# Altium schematic sheet Sheet3.SchDoc
size A3; DocumentNumber: 3; SheetNumber: 3; SheetTotal: 4
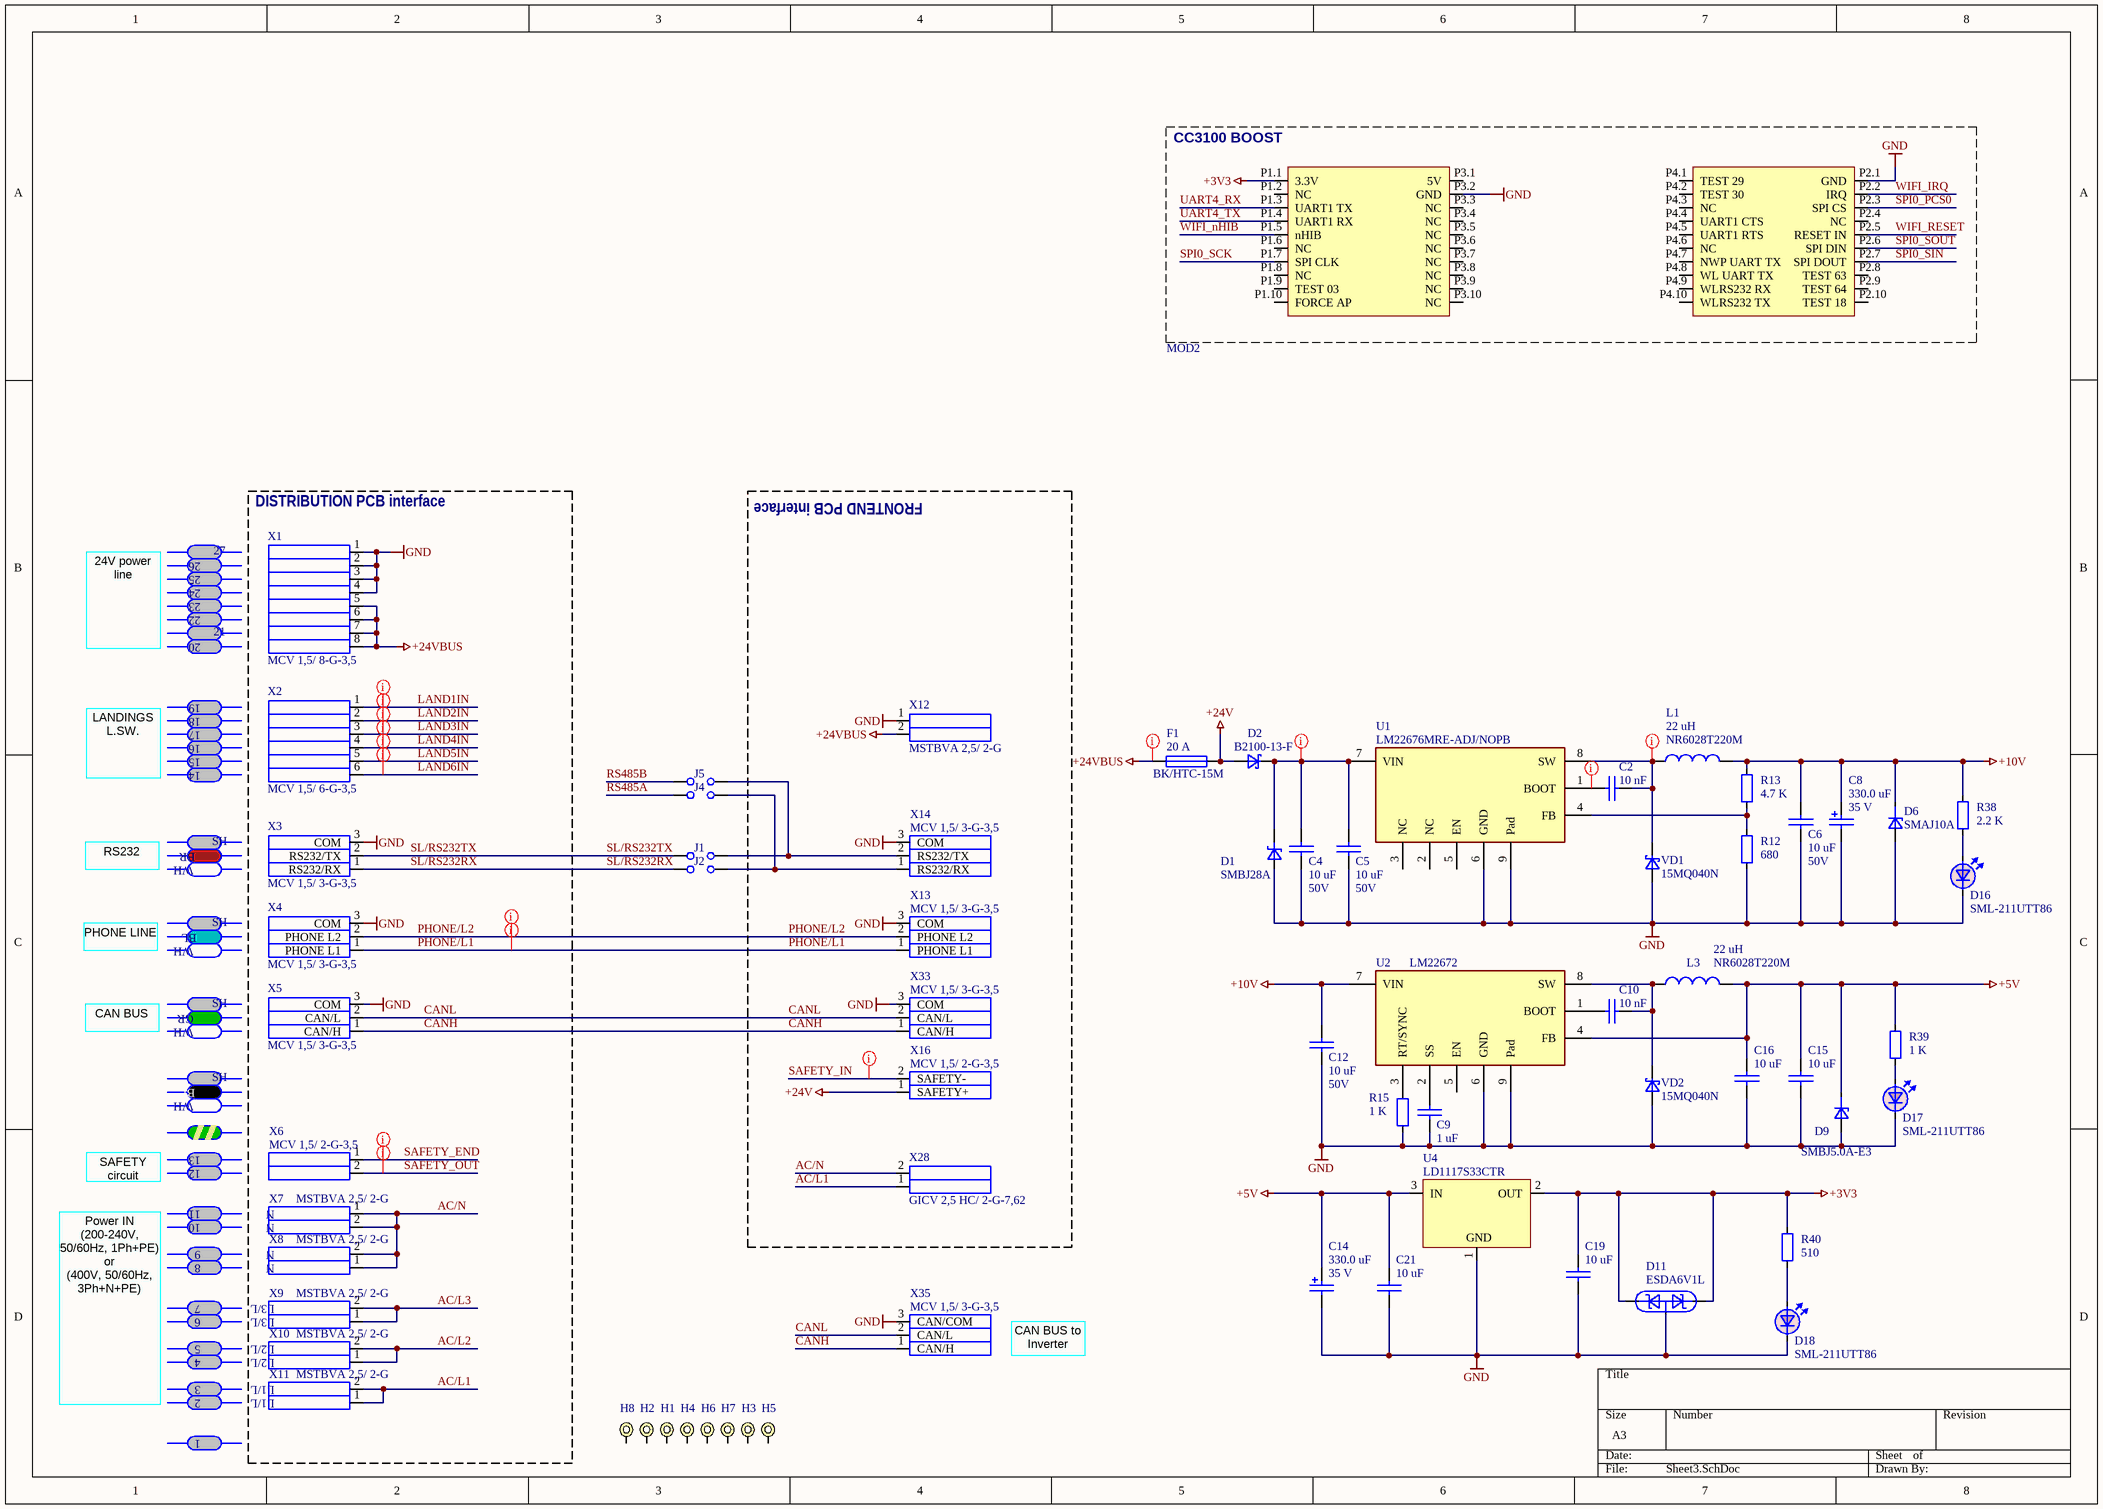
[diagram p0: Sheet3.SchDoc]

## Parts
C2  value 10 nF  [1608[0603]]  (hidden comment: CVNF010K0603)
C4  value 10 uF  Voltage: 50V  [3225[1210]]  (hidden comment: GRM32DF51H106ZA01L)
C5  value 10 uF  Voltage: 50V  [3225[1210]]  (hidden comment: GRM32DF51H106ZA01L)
C6  value 10 uF  Voltage: 50V  [3225[1210]]  (hidden comment: GRM32DF51H106ZA01L)
C8  value 330.0 uF  Voltage: 35 V  [Alum.SMD Cap. 10*10]  (hidden comment: UUD1V331MNL1GS)
C9  value 1 uF  [2012[0805]]  (hidden comment: GRM21BR71A105KA01L)
C10  value 10 nF  [1608[0603]]  (hidden comment: CVNF010K0603)
C12  value 10 uF  Voltage: 50V  [3225[1210]]  (hidden comment: GRM32DF51H106ZA01L)
C14  value 330.0 uF  Voltage: 35 V  [Alum.SMD Cap. 10*10]  (hidden comment: UUD1V331MNL1GS)
C15  value 10 uF  [0805-1206]  (hidden comment: C2012X5R1C106K085AC)
C16  value 10 uF  [0805-1206]  (hidden comment: C2012X5R1C106K085AC)
C19  value 10 uF  [0805-1206]  (hidden comment: C2012X5R1C106K085AC)
C21  value 10 uF  [0805-1206]  (hidden comment: C2012X5R1C106K085AC)
D1  SMBJ28A  [DO-214AA_SMBJ]
D2  B2100-13-F  [SMB ST]
D6  SMAJ10A  [SMA]
D9  SMBJ5.0A-E3  [DO-214AA_SMBJ]
D11  ESDA6V1L  [SOT23]
D16  SML-211UTT86  [0805 LED]
D17  SML-211UTT86  [0805 LED]
D18  SML-211UTT86  [0805 LED]
F1  BK/HTC-15M  value 20 A  [FUSE KS21SW]
H1  Hole 3MM Plated  [HOLE_3MM plated]  (value not drawn)  (no BOM)
H2  Hole 3MM Plated  [HOLE_3MM plated]  (value not drawn)  (no BOM)
H3  Hole 3MM Plated  [HOLE_3MM plated]  (value not drawn)  (no BOM)
H4  Hole 3MM Plated  [HOLE_3MM plated]  (value not drawn)  (no BOM)
H5  Hole 3MM Plated  [HOLE_3MM plated]  (value not drawn)  (no BOM)
H6  Hole 3MM Plated  [HOLE_3MM plated]  (value not drawn)  (no BOM)
H7  Hole 3MM Plated  [HOLE_3MM plated]  (value not drawn)  (no BOM)
H8  Hole 3MM Plated  [HOLE_3MM plated]  (value not drawn)  (no BOM)
J1  PH1-02-TA-HT  [HDR1X2V]  (value not drawn)
J2  PH1-02-TA-HT  [HDR1X2V]  (value not drawn)
J4  PH1-02-TA-HT  [HDR1X2V]  (value not drawn)
J5  PH1-02-TA-HT  [HDR1X2V]  (value not drawn)
L1  NR6028T220M  value 22 uH  [NR6028 yuden]
L3  NR6028T220M  value 22 uH  [NR6028 yuden]
MOD2  CC3100BOOST  [CC3100BOOST]  (value not drawn)  (no BOM)
R12  value 680  [0603]  (hidden comment: RL0603E680-1)
R13  value 4.7 K  [0603]  (hidden comment: RL0603K004.7-1)
R15  value 1 K  [0603]  (hidden comment: RC0603FR-071KL)
R38  value 2.2 K  [0603]  (hidden comment: RC0603FR-072K2L)
R39  value 1 K  [0603]  (hidden comment: RC0603FR-071KL)
R40  value 510  [0603]  (hidden comment: RL0603E510-1)
U1  LM22676MRE-ADJ/NOPB  [SOIC-8 EDP]
U2  LM22672  [SOIC-8 EDP]
U4  LD1117S33CTR  [SOT-223]
VD1  15MQ040N  [SMA]
VD2  15MQ040N  [SMA]
X1  MCV 1,5/ 8-G-3,5  [mcv1.5-8-g_3.5]
X2  MCV 1,5/ 6-G-3,5  [mcv1.5-6-g_3.5]
X3  MCV 1,5/ 3-G-3,5  [mcv1.5-3-g_3.5]
X4  MCV 1,5/ 3-G-3,5  [mcv1.5-3-g_3.5]
X5  MCV 1,5/ 3-G-3,5  [mcv1.5-3-g_3.5]
X6  MCV 1,5/ 2-G-3,5  [mcv1.5-2-g_3.5]
X7  MSTBVA 2,5/ 2-G  [CIM020P1]
X8  MSTBVA 2,5/ 2-G  [CIM020P1]
X9  MSTBVA 2,5/ 2-G  [CIM020P1]
X10  MSTBVA 2,5/ 2-G  [CIM020P1]
X11  MSTBVA 2,5/ 2-G  [CIM020P1]
X12  MSTBVA 2,5/ 2-G  [CIM020P1]
X13  MCV 1,5/ 3-G-3,5  [mcv1.5-3-g_3.5]
X14  MCV 1,5/ 3-G-3,5  [mcv1.5-3-g_3.5]
X16  MCV 1,5/ 2-G-3,5  [mcv1.5-2-g_3.5]
X28  GICV 2,5 HC/ 2-G-7,62  [1756485 GICV 2,5 HC/2 -G-7,62]
X33  MCV 1,5/ 3-G-3,5  [mcv1.5-3-g_3.5]
X35  MCV 1,5/ 3-G-3,5  [mcv1.5-3-g_3.5]

## Blocks framed on the sheet
DISTRIBUTION PCB interface: X1-X11
FRONTEND PCB interface: X12-X14 X16 X28 X33

## Nets
+3V3: C19.2 D11.1 D11.2 MOD2.P1.1(3.3V) R40.2 U4.2(OUT)
+5V: C14.1 C15.2 C16.2 C21.2 D9.1(C) L3.2 R39.2 U2.4(FB) U4.3(IN)
+10V: C6.1 C8.1 C12.1 D6.1 L1.2 R13.2 R38.2 U2.7(VIN)
+24V: D2.1(A) F1.1 X16.1(SAFETY+)
+24VBUS: F1.2 X1.5 X1.6 X1.7 X1.8 X12.2
GND: C4.2 C5.2 C6.2 C8.2 C9.1 C12.2 C14.2 C15.1 C16.1 C19.1 C21.1 D1.2(A) D6.2 D9.2(A) D11.3 D16.2 D17.2 D18.2 MOD2.P2.1(GND) MOD2.P3.2(GND) R12.1 R15.1 U1.6(GND) U1.9(Pad) U2.6(GND) U2.9(Pad) U4.1(GND) VD1.2 VD2.2 X1.1 X1.2 X1.3 X1.4 X3.3(COM) X4.3(COM) X5.3(COM) X12.1 X13.3(COM) X14.3(COM) X33.3(COM) X35.3(CAN/COM)
AC/L1: X11.1 X11.2 X28.1
AC/L2: X10.1 X10.2
AC/L3: X9.1 X9.2
AC/N: X7.1 X7.2 X8.1 X8.2 X28.2
CANH: X5.1(CAN/H) X33.1(CAN/H) X35.1(CAN/H)
CANL: X5.2(CAN/L) X33.2(CAN/L) X35.2(CAN/L)
LAND1IN: X2.1
LAND2IN: X2.2
LAND3IN: X2.3
LAND4IN: X2.4
LAND5IN: X2.5
LAND6IN: X2.6
PHONE/L1: X4.1(PHONE_L1) X13.1(PHONE_L1)
PHONE/L2: X4.2(PHONE_L2) X13.2(PHONE_L2)
RS485A: J4.1
RS485B: J5.1
SAFETY_END: X6.1
SAFETY_IN: X16.2(SAFETY-)
SAFETY_OUT: X6.2
SL/RS232RX: J2.1 X3.1(RS232/RX)
SL/RS232TX: J1.1 X3.2(RS232/TX)
SPI0_PCS0: MOD2.P2.3(SPI_CS)
SPI0_SCK: MOD2.P1.7(SPI_CLK)
SPI0_SIN: MOD2.P2.7(SPI_DOUT)
SPI0_SOUT: MOD2.P2.6(SPI_DIN)
UART4_RX: MOD2.P1.3(UART1_TX)
UART4_TX: MOD2.P1.4(UART1_RX)
WIFI_IRQ: MOD2.P2.2(IRQ)
WIFI_nHIB: MOD2.P1.5(nHIB)
WIFI_RESET: MOD2.P2.5(RESET_IN)
NetC2_1: C2.1 L1.1 U1.8(SW) VD1.1
NetC2_2: C2.2 U1.1(BOOT)
NetC4_1: C4.1 C5.1 D1.1(C) D2.2(C) U1.7(VIN)
NetC9_2: C9.2 U2.2(SS)
NetC10_1: C10.1 L3.1 U2.8(SW) VD2.1
NetC10_2: C10.2 U2.1(BOOT)
NetD16_1: D16.1 R38.1
NetD17_1: D17.1 R39.1
NetD18_1: D18.1 R40.1
NetJ1_2: J1.2 J5.2 X14.2(RS232/TX)
NetJ2_2: J2.2 J4.2 X14.1(RS232/RX)
NetR12_2: R12.2 R13.1 U1.4(FB)
NetR15_2: R15.2 U2.3(RT/SYNC)

Not connected (* = marked no-connect by the designer): H1 0; H2 0; H3 0; H4 0; H5 0; H6 0; H7 0; H8 0; MOD2 P1.2(NC) P1.6(NC) P1.8(NC) P1.9(TEST_03) P1.10(FORCE_AP) P2.4(NC) P2.8(TEST_63) P2.9(TEST_64) P2.10(TEST_18) P3.1(5V) P3.3(NC) P3.4(NC) P3.5(NC) P3.6(NC) P3.7(NC) P3.8(NC) P3.9(NC) P3.10(NC) P4.1(TEST_29) P4.2(TEST_30) P4.3(NC) P4.4(UART1_CTS) P4.5(UART1_RTS) P4.6(NC) P4.7(NWP_UART_TX) P4.8(WL_UART_TX) P4.9(WLRS232_RX) P4.10(WLRS232_TX); U1 2(NC) 3(NC) 5(EN); U2 5(EN)

## Layout directives
net class 24V: +24VBUS, LAND1IN, LAND2IN, LAND3IN, LAND4IN, LAND5IN, LAND6IN, NetC2_1, NetC2_2, NetC4_1, SAFETY_END, SAFETY_IN, SAFETY_OUT
net class 100V: PHONE/L1, PHONE/L2

## Notes on the sheet
- 26
- 25
- 24
- 27
- 24V power line
- 23
- 22
- 20
- 21
- 19
- 18
- 17
- LANDINGS L.SW.
- 16
- 15
- 14
- WH
- BR
- SH
- RS232
- PHONE LINE
- BL
- CAN BUS
- GR
- SAFETY circuit
- 13
- 12
- 11
- 10
- 9
- 8
- N
- 7
- 6
- L3/L
- 5
- 4
- 3
- 2
- L1/L
- L2/L
- CAN BUS to Inverter
- Power IN (200-240V, 50/60Hz, 1Ph+PE)
  or
  (400V, 50/60Hz, 3Ph+N+PE)
- 1
- (in symbol CC3100BOOST) CC3100 BOOST

## Library data of the parts
C2 C10 = CVNF010K0603: 10 nF, 50V, 10%, X7R, 0603 SMD MLC Capacitor; Manufacturer: Murata Electronics; PartNum: 490-1512-1-ND; PartName: GRM188R71H103KA01D; Tolerance: +-10%; Distributor: Digi-Key; Price: 0.006$; Voltage: 50 V
C4-C6 C12 = GRM32DF51H106ZA01L: 10uF, 50V, 20%, Y5V (F), 1210; Manufacturer: Taiyo Yuden; PartNum: 587-2225-2-ND; PartName: UMK325BJ106MM-T; Tolerance: 20%; Price: 0.16$; Distributor: Digi-Key
C8 C14 = UUD1V331MNL1GS: Low ESR SMD alum.el.capacitor 35V, 330uF, 90 mOhm, 670 mA, 10x10, -50...+105 C; Manufacturer: Nichicon; PartNum: 493-2293-1-ND; Tolerance: 20%; Distributor: Digi-Key; Price: 1.1$; PartName: UUD1V331MNL1GS
C9 = GRM21BR71A105KA01L: 1 uF, 10V, 10%, X7R, 0805; Manufacturer: Murata; PartNum: 311-1458-1-ND; PartName: CC0805KKX7R6BB105; Tolerance: 10%; Price: 0.02$; Distributor: Mouser; Voltage: 10 V
C15 C16 C19 C21 = LMK212F106ZG-T: 10 uF, 16V, X5R, ±10%, 0805; Manufacturer: Taiyo Yuden; Distributor: Digi-Key; Price: 0.0347 Euro; Tolerance: ±10%; PartNum: C2012X5R1C106K085AC; Voltage: 16V; PartName: C2012X5R1C106K085AC
D1 = SMBJ28A: DIODE TVS 28V 600W UNI 5% SMD; Manufacturer: Littelfuse; PartNum: SMBJ28ABCT-ND; Distributor: DigiKey; Price: 0.18$; PartName: SMBJ28A; Value: 28 V
D2 = B2100-13-F: DIODE SCHOTTKY 100V 2A SMB; Manufacturer: Diodes Inc; PartNum: B2100-FDICT-ND; Price: 0.31$; Distributor: Digi-Key; PartName: B2100-13-F
D6 = SMAJ10A: DIODE TVS 28V 400W UNI 5% SMD; Manufacturer: Bourns Inc.; PartNum: SMAJ10ABCT-ND; Value: 10V; Distributor: Digi-Key; Price: 0.21$; PartName: SMAJ10A
D9 = SMBJ5.0A-E3: TVS 600W 5.0V Unidirect; Manufacturer: Vishay/General Semiconductor; PartNum: SMBJ5.0A-E3/52GICT-ND; Distributor: Digi-Key; Price: 0.23$; PartName: SMBJ5.0A-E3
D11 = ESDA6V1L: Dual transil array for ESD, 6.1 V, 300 W; Manufacturer: Micro Commercial Co; PartNum: ESDA6V1L-TPCT-ND; PartName: ESDA6V1L-TP; Distributor: Digi-Key; Price: 0.23$
D16-D18 = SML-211UTT86: 0805 red LED, hibright, 2 mA, 1.8V, 130°; Manufacturer: Rohm; PartNum: 511-1292-1-ND; Distributor: Digi-Key; Price: 0.34$; Value: Red; PartName: SML-211UTT86
F1 = BK/HTC-15M: FUSE HOLDER KS21SW; Manufacturer: Cooper/Bussmann; PartNum: 283-2923-ND; Distributor: Digi-Key; Price: 0.74$; PartName: BK/HTC-15M
J1 J2 J4 J5 = Jumper: 2 Pos. 2.54 mm Single Row Through Hole Straight Pin Header; Manufacturer: ADAM TECH; Distributor: Future; Price: 0.02 Euro; PartNum: PH1-02-TA-HT; PartName: PH1-02-TA-HT
L1 L3 = NR6028T220M: 22uH, 1.3 A, 0.175 Ohms, +-20%,- 25 C to + 120 C; Manufacturer: Taiyo Yuden; PartNum: 587-2103-1-ND; Tolerance: ±20%; Distributor: Digi-Key; Price: 0.29$; PartName: NR6028T220M
R12 = RL0603E680-1: 680 R, 1%, 0603, SMD Resistor, Taped; Manufacturer: Vishay; Voltage: 75 V; Distributor: Schukat; Price: 0.002 Euro; Tolerance: 1%; PartNum: RL0603E680-1; PartName: RL0603E680-1
R13 = RL0603K004.7-1: 4.7 K, 1%, 0603, SMD Resistor, Taped; Manufacturer: Vishay; Voltage: 75 V; Distributor: Schukat; Price: 0.002 Euro; Tolerance: 1%; PartNum: RL0603K004.7-1; PartName: RL0603K004.7-1
R15 R39 = RL0603K001-1: 1 K, 1%, 0603, SMD Resistor, Taped; Manufacturer: YAGEO AMERICA CORPORATION; Voltage: 75 V; Distributor: Future; Price: 0.0017$; Tolerance: 1%; PartNum: RC0603FR-071KL; PartName: RC0603FR-071KL
R38 = RL0603K002.2-1: 2.2 K, 1%, 0603, SMD Resistor, Taped; Manufacturer: YAGEO AMERICA CORPORATION; Voltage: 75 V; Distributor: Future; Price: 0.0017$; Tolerance: 1%; PartNum: RC0603FR-072K2L; PartName: RC0603FR-072K2L
R40 = RL0603E510-1: 510 R, 1%, 0603, SMD Resistor, Taped; Manufacturer: Vishay; Voltage: 75 V; Distributor: Schukat; Price: 0.002 Euro; Tolerance: 1%; PartNum: RL0603E510-1; PartName: RL0603E510-1
U1 = LM22676MRE-ADJ/NOPB: IC REG SWITCH BUCK 3A ADJ 8PSOP; Manufacturer: National Semiconductor; PartNum: LM22676MRE-ADJCT-ND; Price: 4.38$; Distributor: Digi-Key; PartName: LM22676MRE-ADJ/NOPB
U2 = LM22672MRE-5.0: SIMPLESWITCH, 1.0A 4.5~42VIN, 8PSOP; Manufacturer: National Semiconductor; PartNum: LM22672MRE-5.0CT-ND; PartName: LM22672MRE-5.0/NOPB; Price: 4.09$; Distributor: Digi-Key
U4 = LD1117S33CTR: Low drop positive voltage regulator, 3.3 V, 1A, SOT-223; Manufacturer: STMicroelectronics; PartNum: 497-1241-1-ND; Distributor: Digi-Key; Price: 0.59$; PartName: LD1117S33CTR
VD1 VD2 = 15MQ040N: Schottky Power Rectifier 3A, 40V, SMA; Manufacturer: VISHAY; Price: 0.8; Distributor: TME; PartNum: 15MQ040N; PartName: 15MQ040N
X1 = MCV1.5/8-G-3.5: HEADER, VERTICAL, 3.5MM, 8WAY; Manufacturer: PHOENIX CONTACT; PartNum: 1843664; Distributor: Phoenix Contact; Price: 0.88 Euro; PartName: MCV 1,5/ 8-G-3,5
X2 = MCV1.5/6-G-3.5: HEADER, VERTICAL, 3.5MM, 6WAY; Manufacturer: PHOENIX CONTACT; PartNum: 1843648; Distributor: Phoenix Contact; Price: 0.66 Euro; PartName: MCV 1,5/ 6-G-3,5
X3-X5 X13 X14 X33 X35 = MCV1.5/3-G-3.5: Header, 8 A, 160 V, 3.5 mm pitch, 3 pos; Manufacturer: Phoenix Contact; PartNum: 1843619; Distributor: Phoenix Contact; Price: 0.32 Euro; PartName: MCV 1,5/ 3-G-3,5
X6 X16 = MCV1.5/2-G-3.5: HEADER, VERTICAL, 3.5MM, 2WAY; Manufacturer: PHOENIX CONTACT; PartNum: 1843606; Distributor: Phoenix Contact; Price: 0.22 Euro; PartName: MCV 1,5/ 2-G-3,5
X7-X12 = 796636-2: TERM BLOCK HEADER 2POS 5.08MM; Manufacturer: Phoenix Contact; PartNum: 1755516; Distributor: Phoenix Contact; Price: 0.204 Euro; PartName: MSTBVA 2,5/ 2-G
X28 = GICV 2,5 HC/ 2-G-7,62: Header, Nominal current: 16 A, Rated voltage (III/2): 630 V, Number of positions: 2, Pitch: 7.62 mm, Color: green; Manufacturer: PHOENIX CONTACT; PartNum: 1756485; Distributor: PHOENIX CONTACT; Price: 0.66 Euro; PartName: GICV 2,5 HC/ 2-G-7,62